# EAGLE design data_proV1.2 (EAGLE 7.6.0)
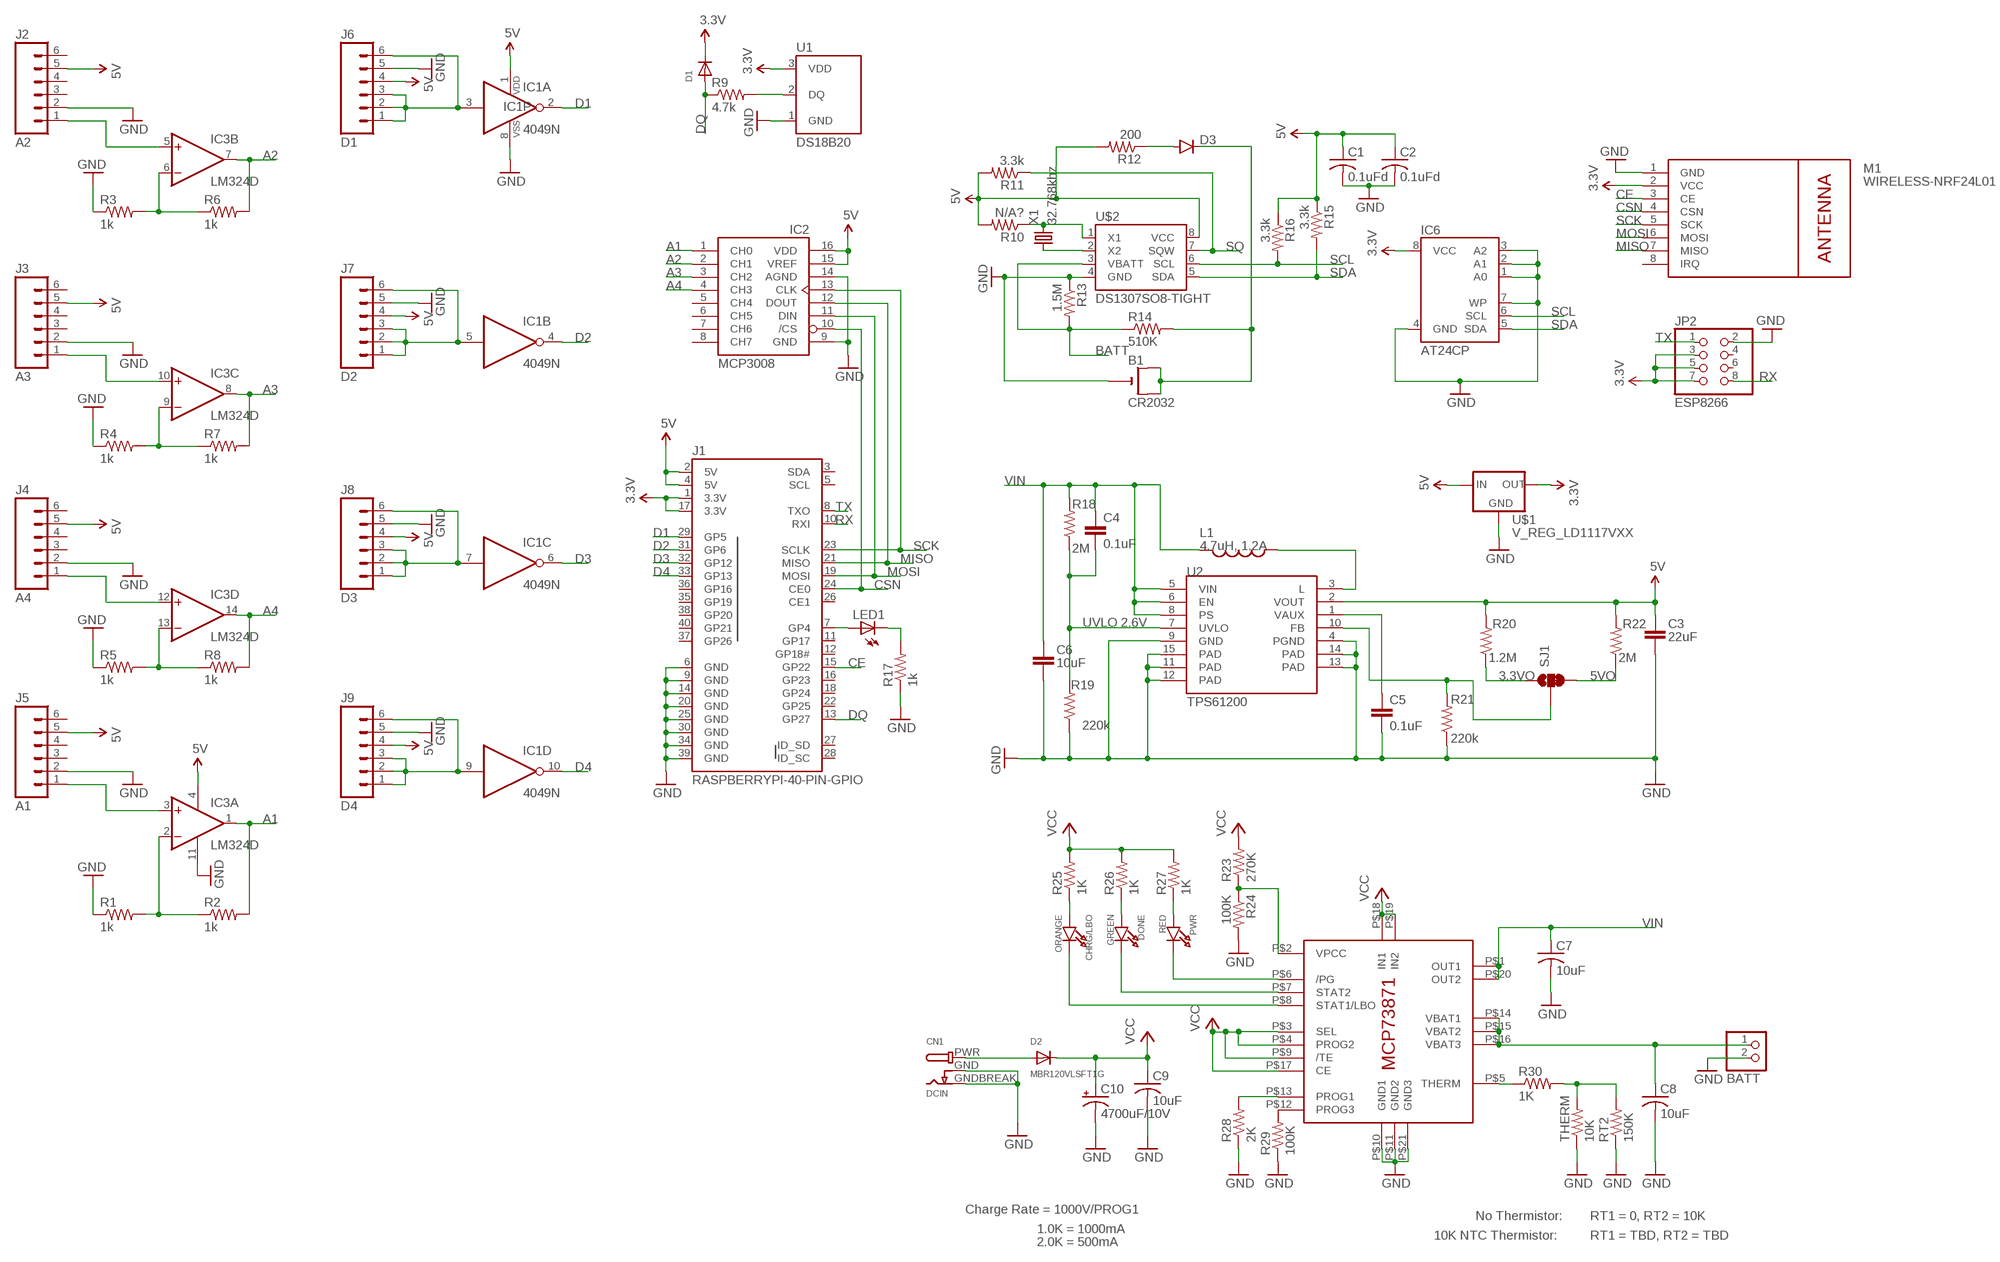
[diagram p0: schematic, sheet 1]

## Parts
B1  CR2032  CR2032SMT  [CR2032-SMD]
BATT  JST_2PIN-SMT-RA  [JST-PH-2-SMT-RA]
C1  0.1uFd  C-USC0805  [C0805]
C2  0.1uFd  C-USC0805  [C0805]
C3  22uF  CAP0805  [0805]
C4  0.1uF  CAP0603-CAP  [0603-CAP]
C5  0.1uF  CAP0603-CAP  [0603-CAP]
C6  10uF  CAP1206  [1206]
C7  10uF  C-USC0805K  [C0805K]
C8  10uF  C-USC0805K  [C0805K]
C9  10uF  C-USC0805K  [C0805K]
C10  4700uF/10V  CPOL-USE5-13  [E5-13]
CHRG/LBO  ORANGE  LED0805_NOOUTLINE  [CHIPLED_0805_NOOUTLINE]
CN1  DCIN  DCBARRELSMT  [DCJACK_2MM_SMT]
D1  DIODESOD-323F  [SOD-323F]
D2  MBR120VLSFT1G  DIODESOD-123  [SOD-123]
D3  DIODESMB  [SMB-DIODE]
DONE  GREEN  LED0805_NOOUTLINE  [CHIPLED_0805_NOOUTLINE]
IC1  4049N  [DIL16]
IC2  MCP3008  [DIL16]
IC3  LM324D  [SO14]
IC4  MCP73871  [QFN20_4MM]
IC6  AT24CP  [DIL08]
J1  RASPBERRYPI-40-PIN-GPIO  [2X20-SHROUDED]
J2  A2  M06VERNIER-ANALOG  [BTA]
J3  A3  M06VERNIER-ANALOG  [BTA]
J4  A4  M06VERNIER-ANALOG  [BTA]
J5  A1  M06VERNIER-ANALOG  [BTA]
J6  D1  M06VERNIER-DIGITAL  [BTD]
J7  D2  M06VERNIER-DIGITAL  [BTD]
J8  D3  M06VERNIER-DIGITAL  [BTD]
J9  D4  M06VERNIER-DIGITAL  [BTD]
JP2  ESP8266  PINHD-2X4  [2X04]
L1  4.7uH, 1.2A  INDUCTOR.  [CDRH2D09]
LED1  LEDCHIP-LED0805  [CHIP-LED0805]
M1  WIRELESS-NRF24L01  [WIRELESS-NRF24L01]
PWR  RED  LED0805_NOOUTLINE  [CHIPLED_0805_NOOUTLINE]
R1  1k  R-US_R0805  [R0805]
R2  1k  R-US_R0805  [R0805]
R3  1k  R-US_R0805  [R0805]
R4  1k  R-US_R0805  [R0805]
R5  1k  R-US_R0805  [R0805]
R6  1k  R-US_R0805  [R0805]
R7  1k  R-US_R0805  [R0805]
R8  1k  R-US_R0805  [R0805]
R9  4.7k  R-US_R0805  [R0805]
R10  N/A?  R-US_R0805  [R0805]
R11  3.3k  R-US_R0805  [R0805]
R12  200  R-US_R0805  [R0805]
R13  1.5M  R-US_R0805  [R0805]
R14  510K  R-US_R0805  [R0805]
R15  3.3k  R-US_R0805  [R0805]
R16  3.3k  R-US_R0805  [R0805]
R17  1k  R-US_R0805  [R0805]
R18  2M  RESISTOR0603-RES  [0603-RES]
R19  220k  RESISTOR0603-RES  [0603-RES]
R20  1.2M  RESISTOR0603-RES  [0603-RES]
R21  220k  RESISTOR0603-RES  [0603-RES]
R22  2M  RESISTOR0603-RES  [0603-RES]
R23  270K  R-US_R0805  [R0805]
R24  100K  R-US_R0805  [R0805]
R25  1K  R-US_R0805  [R0805]
R26  1K  R-US_R0805  [R0805]
R27  1K  R-US_R0805  [R0805]
R28  2K  R-US_FLIPFLOP  [0805-THM]
R29  100K  R-US_R0805  [R0805]
R30  1K  R-US_M0805  [M0805]
RT2  150K  R-US_M0805  [M0805]
SJ1  SOLDERJUMPER_2WAYPASTE2&3  [SJ_3_PASTE2&3]
THERM  10K  R-US_FLIPFLOP  [0805-THM]
U1  DS18B20  [TO-92-AMMO]
U2  TPS61200  [QFN-10_PAD]
U$1  V_REG_LD1117VXX  [78XXL]
U$2  DS1307SO8-TIGHT  [SO08-TIGHT]
X1  32.768khz  CRYSTALTC38H  [TC38H]

## Nets
3.3V: D1.C IC6.8(VCC) J1.1(3.3V) J1.17(3.3V) JP2.3 JP2.5 JP2.7 M1.2(VCC) U1.3(VDD) U$1.GND(OUT)
3.3VO: R20.1 SJ1.1
5V: C1.1 C2.1 C3.1 IC1.1(P:VDD) IC2.15(VREF) IC2.16(VDD) IC3.4(P:V+) J1.2(5V) J1.4(5V) J2.5 J3.5 J4.5 J5.5 J6.4 J7.4 J8.4 J9.4 R10.2 R11.2 R12.2 R15.1 R16.1 R20.2 R22.2 U2.2(VOUT) U$1.OUT(IN) U$2.8(VCC)
5VO: R22.1 SJ1.3
A1: IC2.1(CH0) IC3.1(A:OUT) R2.2
A2: IC2.2(CH1) IC3.7(B:OUT) R6.2
A3: IC2.3(CH2) IC3.8(C:OUT) R7.2
A4: IC2.4(CH3) IC3.14(D:OUT) R8.2
BATT: R13.2 R14.1 U$2.3(VBATT)
BATT1: BATT.1 C8.1 IC4.P$14(VBAT1) IC4.P$15(VBAT2) IC4.P$16(VBAT3)
CE: J1.15(GP22) M1.3(CE)
CSN: IC2.10(/CS) J1.24(CE0) M1.4(CSN)
D1: IC1.2(A:O) J1.29(GP5)
D2: IC1.4(B:O) J1.31(GP6)
D3: IC1.6(C:O) J1.32(GP12)
D4: IC1.10(D:O) J1.33(GP13)
DQ: D1.A J1.13(GP27) R9.1
FB: R21.2 SJ1.2 U2.10(FB)
GND: B1.- BATT.2 C1.2 C2.2 C3.2 C5.2 C6.2 C7.2 C8.2 C9.2 C10.- CN1.GND(GNDBREAK) CN1.GNDBREAK(GND) IC1.8(P:VSS) IC2.9(GND) IC2.14(AGND) IC3.11(P:V-) IC4.P$10(GND1) IC4.P$11(GND2) IC4.P$21(GND3) IC6.1(A0) IC6.2(A1) IC6.3(A2) IC6.4(GND) IC6.7(WP) J1.6(GND) J1.9(GND) J1.14(GND) J1.20(GND) J1.25(GND) J1.30(GND) J1.34(GND) J1.39(GND) J2.2 J3.2 J4.2 J5.2 J6.5 J7.5 J8.5 J9.5 JP2.2 M1.1(GND) R1.1 R3.1 R4.1 R5.1 R13.1 R17.1 R19.1 R21.1 R24.2 R28.1 R29.1 RT2.1 THERM.1 U1.1(GND) U2.4(PGND) U2.9(GND) U2.11(PAD) U2.12(PAD) U2.13(PAD) U2.14(PAD) U2.15(PAD) U$1.IN(GND) U$2.4(GND)
MISO: IC2.12(DOUT) J1.21(MISO) M1.7(MISO)
MOSI: IC2.11(DIN) J1.19(MOSI) M1.6(MOSI)
N$1: U$2.2(X2) X1.1
N$2: R10.1 U$2.1(X1) X1.2
N$3: B1.+$1(+) B1.+$2(+1) D3.C R14.2
N$4: J1.7(GP4) LED1.A
N$5: IC3.2(A:-IN) R1.2 R2.1
N$6: R9.2 U1.2(DQ)
N$7: IC3.13(D:-IN) R5.2 R8.1
N$8: IC3.6(B:-IN) R3.2 R6.1
N$9: L1.P$1 U2.3(L)
N$10: D3.A R12.1
N$11: IC1.3(A:I) J6.1 J6.2 J6.3 J6.6
N$12: IC1.5(B:I) J7.1 J7.2 J7.3 J7.6
N$13: C5.1 U2.1(VAUX)
N$14: IC1.7(C:I) J8.1 J8.2 J8.3 J8.6
N$15: IC1.9(D:I) J9.1 J9.2 J9.3 J9.6
N$16: IC3.9(C:-IN) R4.2 R7.1
N$17: LED1.C R17.2
N$18: IC4.P$2(VPCC) R23.1 R24.1
N$19: IC4.P$6(/PG) PWR.C
N$20: DONE.C IC4.P$7(STAT2)
N$21: CHRG/LBO.C IC4.P$8(STAT1/LBO)
N$22: CHRG/LBO.A R25.1
N$23: DONE.A R26.1
N$24: PWR.A R27.1
N$25: IC4.P$12(PROG3) R29.2
N$26: IC4.P$13(PROG1) R28.2
N$27: IC4.P$5(THERM) R30.1
N$28: R30.2 RT2.2 THERM.2
N$29: CN1.PWR D2.A
RX: J1.10(RXI) JP2.8
S1-5V1: IC3.5(B:+IN) J2.1
S1-5V2: IC3.10(C:+IN) J3.1
S1-5V3: IC3.3(A:+IN) J5.1
S1-5V4: IC3.12(D:+IN) J4.1
SCK: IC2.13(CLK) J1.23(SCLK) M1.5(SCK)
SCL: IC6.6(SCL) R16.2 U$2.6(SCL)
SDA: IC6.5(SDA) R15.2 U$2.5(SDA)
SQ: R11.1 U$2.7(SQW)
TX: J1.8(TXO) JP2.1
UVLO: C4.2 R18.1 R19.2 U2.7(UVLO)
VCC: C9.1 C10.+ D2.C IC4.P$3(SEL) IC4.P$4(PROG2) IC4.P$9(/TE) IC4.P$17(CE) IC4.P$18(IN1) IC4.P$19(IN2) R23.2 R25.2 R26.2 R27.2
VIN: C4.1 C6.1 C7.1 IC4.P$1(OUT1) IC4.P$20(OUT2) L1.P$2 R18.2 U2.5(VIN) U2.6(EN) U2.8(PS)
Unconnected: IC1.11(E:I) IC1.12(E:O) IC1.14(F:I) IC1.15(F:O) IC2.5(CH4) IC2.6(CH5) IC2.7(CH6) IC2.8(CH7) J1.3(SDA) J1.5(SCL) J1.11(GP17) J1.12(GP18#) J1.16(GP23) J1.18(GP24) J1.22(GP25) J1.26(CE1) J1.27(ID_SD) J1.28(ID_SC) J1.35(GP19) J1.36(GP16) J1.37(GP26) J1.38(GP20) J1.40(GP21) J2.3 J2.4 J2.6 J3.3 J3.4 J3.6 J4.3 J4.4 J4.6 J5.3 J5.4 J5.6 JP2.4 JP2.6 M1.8(IRQ)

## Notes on the sheet
- UVLO 2.6V
- Charge Rate = 1000V/PROG1
- No Thermistor: | RT1 = 0, RT2 = 10K
- 1.0K = 1000mA
- 10K NTC Thermistor: | RT1 = TBD, RT2 = TBD
- 2.0K = 500mA

## Library data of the parts
B1 = adafruit:CR2032
BATT = adafruit:JST_2PIN: JST 2-Pin Connectors of various flavors SMT-RA (S2B-PH-SM4) 4UConnector #17311 SMT (B2B-PH-SM4) THM-RA (S2B-PH) THM (B2B-PH)
C1 C2 = resistor:C-US: CAPACITOR, American symbol
C3 C6 = CH_passive:CAP: Capacitor Standard 0603 ceramic capacitor, and 0.1" leaded capacitor.
C4 C5 = SparkFun:CAP: Capacitor Standard 0603 ceramic capacitor, and 0.1" leaded capacitor.
C7-C9 = adafruit:C-US: CAPACITOR, American symbol
C10 = adafruit:CPOL-US: POLARIZED CAPACITOR, American symbol
CHRG/LBO DONE PWR = microbuilder:LED: LED
CN1 = microbuilder:DCBARREL: DC Barrel Jack DCJACK_1.3MM_PTH - Through Hole 1.3mm Jack (4UConnector: 05536) DCJACK_2MM_PTH - Through Hole 2.0/2.1 Jack (4UConnector: 05537) DCJACK_2MM_SMT - SMT 2.0/2.1mm Jack(4UConnector: 03267)
D1 = adafruit:DIODE: Diode
D2 = microbuilder:DIODE: Diode
D3 = SparkFun-DiscreteSemi:DIODE: Diode; PROD_ID: DIO-09646
IC1 = 40xx:4049: Hex inverting BUFFER
IC2 = adafruit:MCP3008
IC3 = linear:LM324: OP AMP
IC4 = adafruit:MCP73871
IC6 = atmel:AT24C*: 2-wire serial EEPROM; MPN: AT24C1024BW-SH-B; OC_FARNELL: 1362646; OC_NEWARK: 03P2044
J1 = SparkFun-Boards:RASPBERRYPI-40-PIN-GPIO: Second Generation Raspberry Pi GPIO Header 2x20 pin connector, as found on B, B+, A+ models.
J2-J9 = SparkFun-Connectors:M06: Header 6 Standard 6-pin 0.1" header. Use with straight break away headers (SKU : PRT-00116), right angle break away headers (PRT-00553), swiss pins (PRT-00743), machine pins (PRT-00117), and female headers (PRT-00115). Molex polarized connector foot print use with SKU : PRT-08094 with associated crimp pins and housings. NOTES ON THE VARIANTS LOCK and LOCK_LONGPADS... This footprint was designed to help hold the alignment of a through-hole component (i.e. 6-pin header) while soldering it into place. You may notice that each hole has been shifted either up or down by 0.005 of an inch from it's more standard position (which is a perfectly straight line). This slight alteration caused the pins (the squares in the middle) to touch the edges of the holes. Because they are alternating, it causes a "brace" to hold the component in place. 0.005 has proven to be the perfect amount of "off-center" position when using our standard breakaway headers. Although looks a little odd when you look at the bare footprint, once you have a header in there, the alteration is very hard to notice. Also,if you push a header all the way into place, it is covered up entirely on the bottom side. This idea of altering the position of holes to aid alignment will be further integrated into the Sparkfun Library for other footprints. It can help hold any component with 3 or more connection pins.
JP2 = adafruit:PINHD-2X4: PIN HEADER
L1 = SparkFun:INDUCTOR: Inductors Basic Inductor/Choke - 0603 and 1206. Footprints are not proven and vary greatly between part numbers.
LED1 = led:LED: LED
M1 = diy-modules:WIRELESS-NRF24L01: 2.4 GHz Wireless Module based on NRF24L01 chip More details available here: http://www.electrodragon.com/w/NRF24L01 Click here to find device on ebay.com <http://www.ebay.com/sch/nrf24l01+arduino>
R1-R9 = resistor:R-US_: RESISTOR, American symbol
R10-R17 R23-R30 RT2 THERM = adafruit:R-US_: RESISTOR, American symbol
R18-R22 = SparkFun:RESISTOR: Resistor Basic schematic elements and footprints for 0603, 1206, and PTH resistors.
SJ1 = SparkFun:SOLDERJUMPER_2WAY: Solder Jumper 2 way solder jumper
U1 = SparkFun-Sensors:DS18B20: Dallas/Maxim DS18B20 1-wire temperature sensor Datasheet: http://datasheets.maximintegrated.com/en/ds/DS18B20.pdf temp thermometer 1-wire one-wire one wire; STORE_ID: SEN-00245
U2 = SparkFun:TPS61200: DC to DC Booster
U$1 = SparkFun-PowerIC:V_REG_LD1117VXX: LD1117VXX voltage regulator. We carry the 3.3V version (COM-00526) in TO-220 package.
U$2 = SparkFun-FreqCtrl:DS1307: I2C real-time clock with battery backup.; PROD_ID: IC-08138
X1 = crystal:CRYSTAL: CRYSTAL; OC_FARNELL: unknown; OC_NEWARK: unknown

## Board
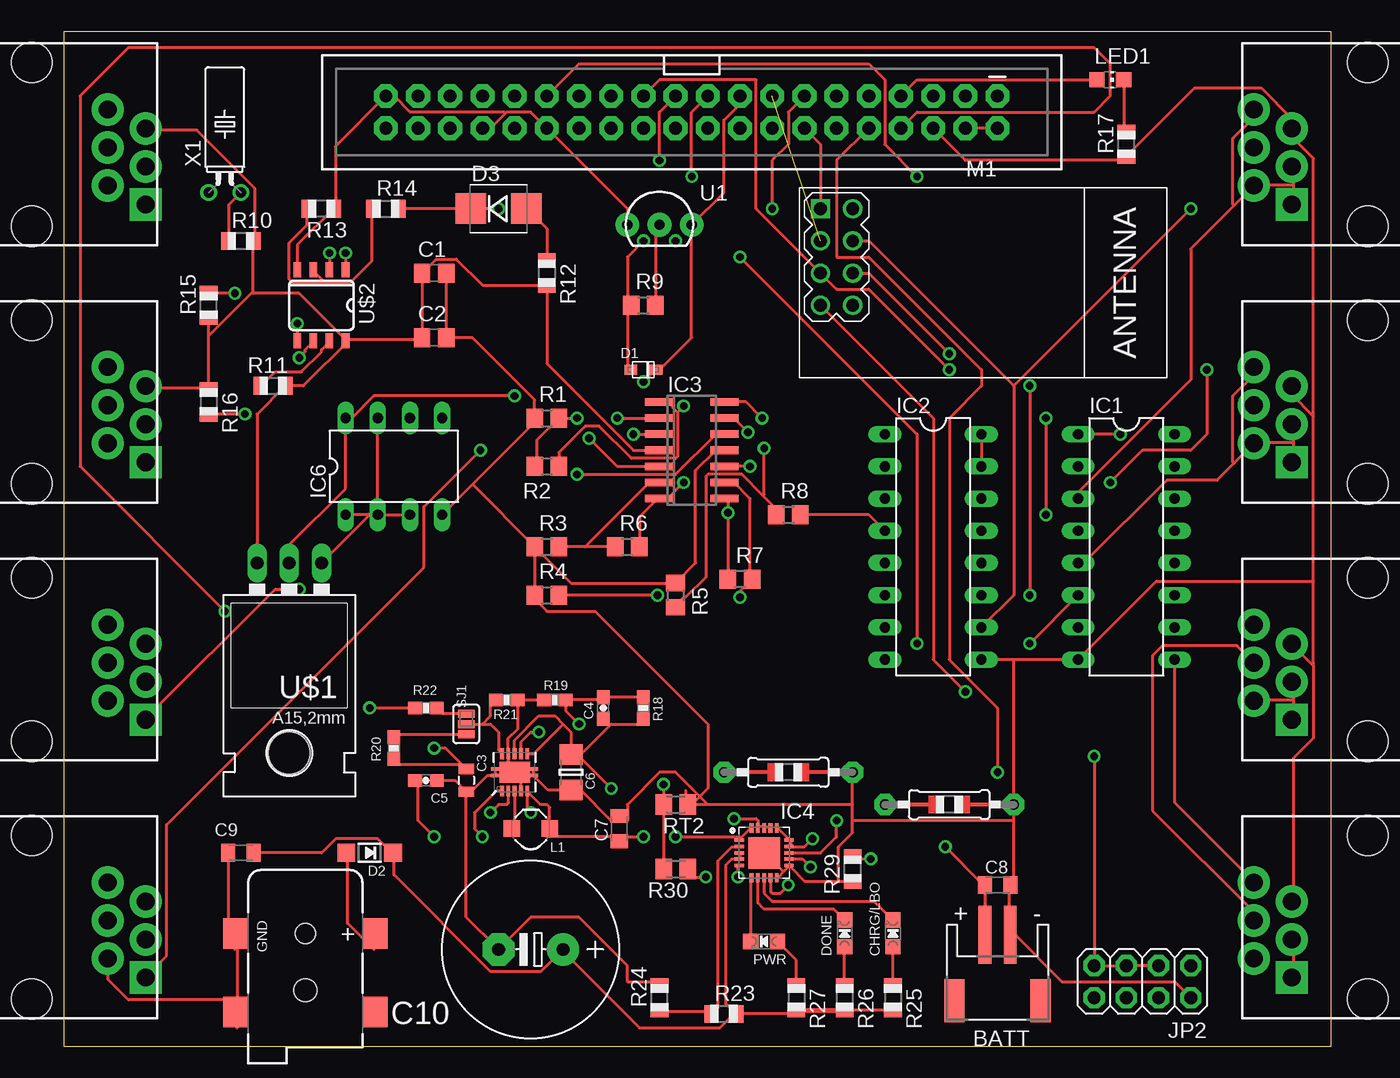
[diagram p1: board, top side]
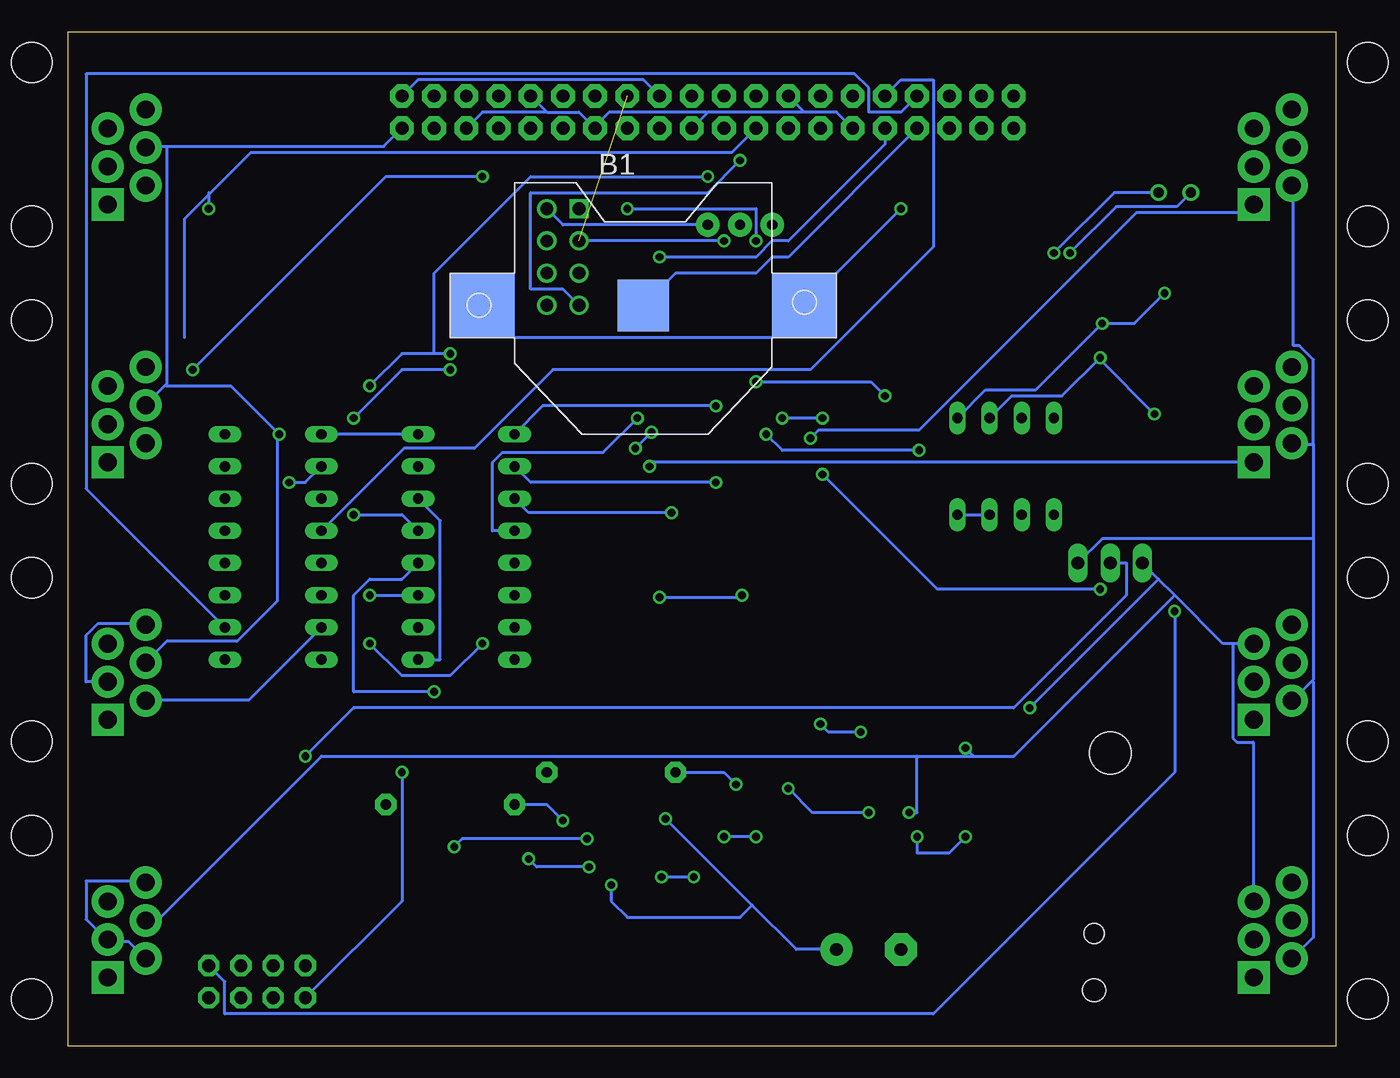
[diagram p2: board, bottom side, seen from below]

Size 100 x 80 mm. Coordinates in mm from the lower left corner, seen from the top.
Outline: 0,0 100,0 100,80 0,80 0,0
Copper layers (1*16): Top 0.035mm / dielectric 1.5mm / Bottom 0.035mm
Design rules "default": minimum track width 10mil, minimum drill 24mil, track to track 8mil, track to pad 8mil, pad to pad 8mil, via to via 8mil, smd to smd 8mil, copper to edge 40mil, drill to drill 8mil, minimum pad ring 10mil, minimum via ring 8mil, stop-mask expansion 4mil, vias tented up to drill 0mil, thermal gap 10mil

### Footprints (pad centres in the part's own frame; a part is rotated, then mirrored left to right if it is on the bottom)
CR2032-SMD = smd 5.08 x 5.08: +$1 -12.7,0; +$2 12.7,0 | smd 4.064 x 4.064: - 0,0
JST-PH-2-SMT-RA = smd 1 x 4.6: 1 1,-3.7; 2 -1,-3.7 | smd 1.6 x 3.4: NC1 -3.4,1.5; NC2 3.4,1.5
C0805 = smd 1.3 x 1.5: 1 -0.95,0; 2 0.95,0
0805 = smd 0.8 x 1.2: 1 -0.9,0; 2 0.9,0
0603-CAP = smd 1.1 x 1: 1 -0.85,0; 2 0.85,0
1206 = smd 1.6 x 1.8: 1 -1.4,0; 2 1.4,0
C0805K = smd 1.1 x 1.4: 1 -1,0; 2 1,0
E5-13 = drill 1.016 pad 2.54: + -2.54,0 | drill 1.016 pad 2.54 octagon: - 2.54,0
CHIPLED_0805_NOOUTLINE = smd 1.2 x 1.2: A 0,-1.05; C 0,1.05
DCJACK_2MM_SMT = smd 2.4 x 2: GND 0,-5.5; GNDBREAK 6.2,-5.5; PWR 0,5.5; PWR2 6.2,5.5 | hole 1.6: 0,0 | hole 1.8: 4.5,0
SOD-323F = smd 1 x 0.8: A -1,0; C 1,0
SOD-123 = smd 1.4 x 1.4: A 1.85,0; C -1.85,0
SMB-DIODE = smd 2.4 x 2.4: A 2.2,0; C -2.2,0
DIL16 = drill 0.813 long: 1 -8.89,-3.81; 2 -6.35,-3.81; 3 -3.81,-3.81; 4 -1.27,-3.81; 5 1.27,-3.81; 6 3.81,-3.81; 7 6.35,-3.81; 8 8.89,-3.81; 9 8.89,3.81; 10 6.35,3.81; 11 3.81,3.81; 12 1.27,3.81; 13 -1.27,3.81; 14 -3.81,3.81; 15 -6.35,3.81; 16 -8.89,3.81
SO14 = smd 0.6 x 2.2: 1 -3.81,-2.6; 2 -2.54,-2.6; 3 -1.27,-2.6; 4 0,-2.6; 5 1.27,-2.6; 6 2.54,-2.6; 7 3.81,-2.6; 8 3.81,2.6; 9 2.54,2.6; 10 1.27,2.6; 11 0,2.6; 12 -1.27,2.6; 13 -2.54,2.6; 14 -3.81,2.6
QFN20_4MM = smd 0.73 x 0.28: P$1 -1.965,1; P$2 -1.965,0.5; P$3 -1.965,0; P$4 -1.965,-0.5; P$5 -1.965,-1; P$11 1.965,-1; P$12 1.965,-0.5; P$13 1.965,0; P$14 1.965,0.5; P$15 1.965,1 | smd 0.28 x 0.73: P$6 -1,-1.965; P$7 -0.5,-1.965; P$8 0,-1.965; P$9 0.5,-1.965; P$10 1,-1.965; P$16 1,1.965; P$17 0.5,1.965; P$18 0,1.965; P$19 -0.5,1.965; P$20 -1,1.965 | smd 2.5 x 2.5: P$21 0,0
DIL08 = drill 0.813 long: 1 -3.81,-3.81; 2 -1.27,-3.81; 3 1.27,-3.81; 4 3.81,-3.81; 5 3.81,3.81; 6 1.27,3.81; 7 -1.27,3.81; 8 -3.81,3.81
2X20-SHROUDED = drill 1.016 pad 1.88 octagon: 1 -1.27,24.13; 2 1.27,24.13; 3 -1.27,21.59; 4 1.27,21.59; 5 -1.27,19.05; 6 1.27,19.05; 7 -1.27,16.51; 8 1.27,16.51; 9 -1.27,13.97; 10 1.27,13.97; 11 -1.27,11.43; 12 1.27,11.43; 13 -1.27,8.89; 14 1.27,8.89; 15 -1.27,6.35; 16 1.27,6.35; 17 -1.27,3.81; 18 1.27,3.81; 19 -1.27,1.27; 20 1.27,1.27; 21 -1.27,-1.27; 22 1.27,-1.27; 23 -1.27,-3.81; 24 1.27,-3.81; 25 -1.27,-6.35; 26 1.27,-6.35; 27 -1.27,-8.89; 28 1.27,-8.89; 29 -1.27,-11.43; 30 1.27,-11.43; 31 -1.27,-13.97; 32 1.27,-13.97; 33 -1.27,-16.51; 34 1.27,-16.51; 35 -1.27,-19.05; 36 1.27,-19.05; 37 -1.27,-21.59; 38 1.27,-21.59; 39 -1.27,-24.13; 40 1.27,-24.13
BTA = drill 1.4 pad 2.54 square: 1 4.75,9 | drill 1.4 pad 2.54: 2 3.25,6; 3 1.75,9; 4 0.25,6; 5 -1.25,9; 6 -2.75,6 | hole 3.2: 6.45,0; -6.45,0
BTD = drill 1.4 pad 2.54 square: 1 -4.75,6 | drill 1.4 pad 2.54: 2 -3.25,9; 3 -1.75,6; 4 -0.25,9; 5 1.25,6; 6 2.75,9 | hole 3.2: 6.45,0; -6.45,0
2X04 = drill 1.016 pad 1.676 octagon: 1 -3.81,-1.27; 2 -3.81,1.27; 3 -1.27,-1.27; 4 -1.27,1.27; 5 1.27,-1.27; 6 1.27,1.27; 7 3.81,-1.27; 8 3.81,1.27
CDRH2D09 = smd 1.3 x 1.3: P$1 -1.5,0; P$2 1.5,0
CHIP-LED0805 = smd 1.2 x 1.2: A 0,-1.05; C 0,1.05
WIRELESS-NRF24L01 = drill 1 square: 1 -12.7,6.35 | drill 1: 2 -10.16,6.35; 3 -12.7,3.81; 4 -10.16,3.81; 5 -12.7,1.27; 6 -10.16,1.27; 7 -12.7,-1.27; 8 -10.16,-1.27
R0805 = smd 1.3 x 1.5: 1 -0.95,0; 2 0.95,0
R0805' = smd 1.1 x 1.4: 1 -1,0; 2 1,0
0603-RES = smd 1.1 x 1: 1 -0.85,0; 2 0.85,0
0805-THM = drill 0.813 pad 1.676 octagon: 1 -5.08,0; 2 5.08,0
M0805 = smd 1.3 x 1.6: 1 -0.95,0; 2 0.95,0
SJ_3_PASTE2&3 = smd 0.635 x 1.27: 1 -0.813,0; 2 0,0; 3 0.813,0
TO-92-AMMO = drill 0.813 pad 1.88: 1 -2.54,0; 2 0,0; 3 2.54,0
QFN-10_PAD = smd 0.297 x 0.85: 1 -1,-1.475; 2 -0.5,-1.475; 3 0,-1.475; 4 0.5,-1.475; 5 1,-1.475; 6 1,1.475; 7 0.5,1.475; 8 0,1.475; 9 -0.5,1.475; 10 -1,1.475 | smd 0.7 x 0.28: 11 -1.5,0.25; 12 -1.5,-0.25; 13 1.5,0.25; 14 1.5,-0.25 | smd 2.4 x 1.65: 15 0,0
78XXL = drill 1.016 long: GND 0,-3.81; IN -2.54,-3.81; OUT 2.54,-3.81 | hole 3.302: 0,11.176
SO08-TIGHT = smd 0.6 x 1.2: 1 -1.905,-2.8; 2 -0.635,-2.8; 3 0.635,-2.8; 4 1.905,-2.8; 5 1.905,2.8; 6 0.635,2.8; 7 -0.635,2.8; 8 -1.905,2.8
TC38H = drill 0.813: 1 -1.27,0; 2 1.27,0

### Placement (x,y rotation side)
B1  54.61,58.42 0 bottom
BATT  73.66,5.08 180 top
C1  29.21,60.96 0 top
C2  29.21,55.88 0 top
C3  31.75,20.95 270 top
C4  42.55,26.67 90 top
C5  28.57,20.95 0 top
C6  40.01,21.59 270 top
C7  43.81,17.14 90 top
C8  73.66,12.7 0 top
C9  13.97,15.24 180 top
C10  36.83,7.62 180 top
CHRG/LBO  65.41,8.89 0 top
CN1  19.05,8.89 270 top
D1  45.72,53.34 0 top
D2  24.13,15.24 180 top
D3  34.29,66.04 0 top
DONE  61.59,8.89 0 top
IC1  83.82,39.37 270 top
IC2  68.58,39.37 270 top
IC3  49.53,46.99 270 top
IC4  55.24,15.24 0 top
IC6  26.04,45.72 0 top
J1  49.53,73.66 270 top
J2  -2.54,71.12 270 top
J3  -2.54,50.8 270 top
J4  -2.54,30.48 270 top
J5  -2.54,10.16 270 top
J6  102.87,71.12 90 top
J7  102.87,50.8 90 top
J8  102.87,30.48 90 top
J9  102.87,10.16 90 top
JP2  85.09,5.08 180 top
L1  36.83,17.14 0 top
LED1  82.55,76.2 270 top
M1  72.39,59.69 0 top
PWR  55.24,8.26 90 top
R1  38.1,49.53 0 top
R2  38.1,45.72 0 top
R3  38.1,39.37 0 top
R4  38.1,35.56 0 top
R5  48.26,35.56 270 top
R6  44.45,39.37 0 top
R7  53.34,36.83 180 top
R8  57.15,41.91 0 top
R9  45.72,58.42 0 top
R10  N/A?  [R0805']  13.97,63.5 0 top
R11  3.3k  [R0805']  16.51,52.07 0 top
R12  200  [R0805']  38.1,60.96 270 top
R13  1.5M  [R0805']  20.32,66.04 180 top
R14  510K  [R0805']  25.4,66.04 0 top
R15  3.3k  [R0805']  11.43,58.42 90 top
R16  3.3k  [R0805']  11.43,50.8 270 top
R17  1k  [R0805']  83.82,71.12 90 top
R18  45.72,26.67 270 top
R19  38.73,27.3 0 top
R20  26.04,23.5 270 top
R21  34.92,27.3 180 top
R22  28.57,26.67 180 top
R23  270K  [R0805']  52.07,2.54 0 top
R24  100K  [R0805']  46.99,3.81 90 top
R25  1K  [R0805']  65.41,3.81 270 top
R26  1K  [R0805']  61.59,3.81 270 top
R27  1K  [R0805']  57.78,3.81 270 top
R28  69.85,19.05 180 top
R29  100K  [R0805']  62.23,13.97 90 top
R30  48.26,13.97 180 top
RT2  48.26,19.05 180 top
SJ1  31.75,25.4 90 top
THERM  57.15,21.59 180 top
U1  46.99,64.77 0 top
U2  35.56,21.59 0 top
U$1  17.78,34.29 180 top
U$2  20.32,58.42 180 top
X1  12.7,67.31 0 top

### Tracks (layer width: path | path; a pad name or v marks a point on that pad's centre or on a via)
3.3V  (via drill 0.61)
  Top 0.254: JP2.3 JP2.5 JP2.7 v81.28,22.86 | U$1.GND 17.78,39.53 22.23,43.97 IC6.8 22.7,49.53 24.45,51.28 v35.56,51.28 | J1.17 53.34,74.3 52.07,73.03 52.07,67.31 U1.3 49.53,55.88 46.99,53.34 D1.C 46.67,53.34 v45.72,52.39
  Bottom 0.254: J1.1 72.39,76.2 54.61,76.2 J1.17 | v35.56,51.28 36.67,52.39 v45.72,52.39 | M1.2 60.96,64.77 U1.3 | v81.28,22.86 77.47,26.67 25.4,26.67 16.51,35.56 16.51,38.1 U$1.GND
3.3VO
  Top 0.254: R20.1 26.28,24.59 SJ1.1
5V  (via drill 0.6, 0.61)
  Top 0.254: 11.43,51.91 6.51,51.91 J3.5 | 11.43,51.91 11.43,56.04 | 11.43,56.04 R15.1 | 11.43,51.91 R16.1 | 11.43,56.04 14.84,59.45 | 14.84,59.45 14.92,59.53 14.92,63.5 R10.2 15.08,63.5 15.08,67.63 10.48,72.23 6.51,72.23 J2.5 | 22.54,55.72 28.1,55.72 C2.1 | 22.54,55.72 22.23,55.72 | 22.54,55.72 18.89,52.07 R11.2 17.46,52.07 15.24,49.85 U$1.OUT | C1.1 29.37,62.07 30.96,62.07 33.02,60.01 38.1,60.01 R12.2 38.1,53.82 44.93,46.99 IC3.4 | C1.1 C2.1 | C2.1 | C1.1 | 22.23,55.72 18.57,59.37 14.92,59.37 14.84,59.45 | 22.23,55.72 U$2.8 | J9.4 93.82,10 93.82,10.64 85.88,18.57 85.88,30.8 86.68,31.59 92.55,31.59 93.82,30.32 J8.4 | IC2.16 IC2.15 | J1.2 J1.4 | v83.34,48.26 IC1.1 | v24.13,26.67 R22.2 | R20.2 26.45,22.23 31.11,22.23 31.48,21.86 C3.1 30.11,23.5 v29.21,23.5 | U2.2 35.06,19.18 34.92,19.05 34.29,19.05 v33.66,18.41
  Bottom 0.254: 12.7,35.56 8.89,31.75 8.1,31.75 | 12.7,35.56 13.97,36.83 | 13.97,36.83 U$1.OUT 15.24,37.94 | 8.1,31.75 6.51,31.75 J4.5 | 8.1,31.75 8.1,24.29 7.78,23.97 6.51,23.97 6.51,11.43 J5.5 | IC2.16 IC1.1 | J1.2 75.09,70.96 92.23,70.96 | 92.23,70.96 93.82,70.96 J6.4 | 92.31,52.15 92.23,52.23 92.23,70.96 | 92.31,52.15 93.82,50.64 J7.4 | 92.31,52.15 92.23,52.07 87.15,52.07 v83.34,48.26 83.5,48.26 83.5,35.08 86.68,31.91 92.23,31.91 93.82,30.32 J8.4 | 13.97,36.83 v24.13,26.67 | 12.7,35.56 25.4,22.86 28.57,22.86 | 33.02,22.86 80.01,22.86 92.71,10.16 J9.4 | 33.02,22.86 28.57,22.86 | v29.21,23.5 28.57,22.86 | v33.66,18.41 33.02,18.41 33.02,22.86
5VO
  Top 0.254: SJ1.3 29.88,26.21 R22.1
A1  (via drill 0.61)
  Top 0.254: 48.42,50.01 48.42,46.51 48.26,46.35 44.77,46.35 42.23,48.9 41.12,48.9 39.05,46.83 R2.2 | 48.42,50.01 47.62,50.8 IC3.1 | 48.42,50.01 v48.9,50.48
  Bottom 0.254: IC2.1 62.55,50.48 v48.9,50.48
A2  (via drill 0.61)
  Top 0.254: R6.2 45.4,41.75 46.83,43.18 IC3.7 47.62,43.18 v48.9,44.45
  Bottom 0.254: IC2.2 63.5,44.45 v48.9,44.45
A3  (via drill 0.61)
  Top 0.254: R7.2 v52.39,42.07 52.39,43.02 52.23,43.18 IC3.8
  Bottom 0.254: IC2.3 63.66,42.07 v52.39,42.07
A4  (via drill 0.61)
  Top 0.254: R8.2 63.5,41.91 IC2.4 | IC3.14 53.82,50.8 v55.09,49.53
  Bottom 0.254: v55.09,49.53 57.78,46.83 65.72,46.83 66.52,46.04 66.52,40.64 IC2.4
BATT
  Top 0.254: 20.56,60.25 20.64,60.17 22.54,60.17 24.29,61.91 24.29,66.04 R14.1 | 20.56,60.25 19.68,61.12 U$2.3 | R13.2 19.21,66.04 19.21,64.77 17.78,63.34 17.78,60.48 18.1,60.17 20.48,60.17 20.56,60.25
BATT1  (via drill 0.61)
  Top 0.254: IC4.P$16 56.36,17.14 57.15,16.35 IC4.P$15 57.31,16.19 57.31,15.88 IC4.P$14 57.31,15.72 58.42,15.72 v59.05,16.35 | BATT.1 72.71,7.62 72.71,12.7 C8.1 72.55,12.7 v69.53,15.72
  Bottom 0.254: v59.05,16.35 68.9,16.35 v69.53,15.72
CE  (via drill 0.61)  (1 unrouted)
  Bottom 0.254: v48.26,63.5 M1.3
CSN  (via drill 0.61)
  Top 0.254: IC2.10 74.93,35.56 74.93,52.07 | 74.93,52.07 63.5,63.5 M1.4 | v88.9,66.04 74.93,52.07
  Bottom 0.254: J1.24 47.62,70.48 85.57,70.48 88.82,67.23 | 88.82,67.23 90.81,65.25 90.81,55.88 | v88.9,66.04 88.9,67.31 88.82,67.23
D1  (via drill 0.61)
  Top 0.254: v82.55,44.45 85.09,46.99 88.9,46.99 90.17,48.26 v90.17,53.34 | v67.31,68.58 64.77,71.12 64.77,76.2 63.5,77.47 40.64,77.47 J1.29
  Bottom 0.254: IC1.2 81.28,44.45 v82.55,44.45 | v90.17,53.34 74.93,68.58 v67.31,68.58
D2
  Bottom 0.254: IC1.4 73.5,47.15 67.94,47.15 61.75,53.34 41.43,53.34 31.75,63.02 31.75,76.2 34.29,76.2 J1.31
D3  (via drill 0.61)
  Top 0.254: v76.2,31.75 IC1.6 | v67.31,31.75 67.31,48.26 v53.34,62.23
  Bottom 0.254: v76.2,31.75 73.66,29.21 69.85,29.21 v67.31,31.75 | v53.34,62.23 45.72,62.23 44.45,63.5 43.18,63.5 35.56,71.12 J1.32
D4
  Bottom 0.254: IC1.10 98.58,43.97 98.58,76.68 37.94,76.68 36.83,75.56 36.83,73.66 34.29,73.66 J1.33
DQ  (via drill 0.61)
  Top 0.254: 44.45,58.42 44.45,53.34 D1.A | 44.45,58.42 44.45,62.23 v45.72,63.5 | v55.88,66.04 55.88,69.85 57.15,71.12 57.15,73.66 J1.13 | 44.45,58.42 R9.1
  Bottom 0.254: v45.72,63.5 45.72,66.04 v55.88,66.04
FB
  Top 0.254: SJ1.2 33.02,25.4 | 33.02,25.4 33.66,26.04 33.66,26.89 R21.2 | 33.02,25.4 33.66,25.4 34.29,24.77 34.29,23.34 U2.10
GND
  Top 0.254: 98.5,30.08 97,31.59 J8.5 | 98.5,30.08 98.58,30 98.58,24.29 97,22.7 97,11.43 J9.5 | 98.5,49.77 98.58,49.69 98.58,36.67 | 98.5,49.77 97,51.28 97,51.91 J7.5 | 98.58,36.67 98.58,30.16 98.5,30.08 | 98.5,49.77 98.58,49.85 98.58,70.01 97,71.6 97,72.23 J6.5 96.84,72.39 96.84,73.18 94.46,75.56 89.22,75.56 83.82,70.17 R17.1 83.82,69.85 71.12,69.85 J1.6 | 49.05,20.16 49.05,19.05 RT2.1 49.53,19.05 | 74.93,30.48 IC1.8 86.2,36.67 98.58,36.67 | 74.93,30.48 IC2.9 | 56.75,13.73 57.15,14.13 IC4.P$11 57.31,14.13 58.42,13.02 61.12,13.02 | 56.75,13.73 56.36,13.34 IC4.P$10 | IC4.P$21 56.75,13.73 | 61.12,13.02 62.23,13.02 R29.1 | 62.23,17.78 62.23,16.83 61.12,15.72 61.12,13.02 | 62.23,17.78 62.23,19.05 | 62.23,19.05 THERM.1 | 74.93,17.78 74.93,12.86 74.77,12.7 C8.2 74.61,12.7 74.61,7.62 BATT.2 74.93,8.89 78.74,5.08 87.63,5.08 JP2.2 | 74.93,17.78 R28.1 74.93,30.48 | 74.93,17.78 62.23,17.78 | 62.23,19.05 50.8,19.05 | 50.8,19.05 49.53,19.05 | U$2.4 18.41,63.18 21.27,66.04 R13.1 21.43,66.04 21.43,70.96 J1.39 26.04,74.93 27.3,73.66 34.77,73.66 34.85,73.58 | J1.34 33.66,72.39 34.85,73.58 | 34.85,73.58 34.92,73.66 36.83,73.66 J1.30 44.45,66.04 U1.1 | 24.13,41.91 IC6.1 | IC6.2 IC6.3 | IC6.2 IC6.7 | 24.13,41.91 U$1.IN | 24.13,41.91 IC6.2 | R3.1 37.15,35.72 | 37.15,35.72 R4.1 | R5.1 40.01,36.51 R3.1 | C2.2 C1.2 | R1.1 37.15,49.21 32.23,44.29 | IC6.4 32.23,44.29 | C2.2 32.23,55.88 37.15,50.96 R1.1 | C2.2 | R1.1 | 32.23,44.29 R3.1 | R3.1 | C9.2 13.02,15.24 13.02,8.1 13.49,7.62 CN1.GND 13.65,7.62 13.65,3.65 | 13.65,3.65 13.65,1.43 CN1.GNDBREAK | 13.65,3.65 5.08,3.65 3.49,5.24 3.49,6.83 J5.2 | IC3.11 51.44,46.99 49.85,45.4 49.85,38.1 R5.1 | R5.1
  Top 0.254: 37.15,35.72 R4.1 | C3.2 31.75,10.16 C10.- 36.83,10.16 40.64,10.16 44.45,6.35 44.45,5.08 46.99,5.08 R24.2 | 50.8,19.05 48.26,21.59 46.99,21.59 44.45,19.05 44.45,17.78 C7.2 43.18,17.78 40.64,20.32 C6.2 38.21,20.19 U2.14 U2.13 35.81,21.84 U2.15 | R19.1 R21.1 35.77,24.98 35.06,24.27 U2.9 35.06,22.09 U2.15 | C3.2 32.12,20.05 33.41,21.34 U2.12 U2.11 35.31,21.84 U2.15 | U2.4 36.06,21.09 U2.15 | C5.2 30.85,20.95 C3.2 | M1.1 59.69,71.12 J1.14 | 49.53,19.05 50.8,20.32 50.8,25.4 41.91,34.29 38.1,34.29 36.83,35.56 R4.1
  Bottom 0.254: IC2.14 70.64,41.43 70.64,30.48 IC2.9 | J1.9 62.31,73.74 | 62.31,73.74 62.23,73.66 59.69,73.66 J1.14 58.42,72.55 57.31,73.66 49.69,73.66 49.61,73.58 | J1.6 67.31,73.66 62.39,73.66 62.31,73.74 | 41.99,73.74 41.91,73.66 39.37,73.66 J1.30 | 41.99,73.74 J1.25 | 49.61,73.58 49.53,73.66 42.07,73.66 41.99,73.74 | 49.61,73.58 J1.20 | IC6.4 IC6.3 | 1.83,28.81 1.75,28.89 1.75,40.01 | 1.83,28.81 3.33,27.3 J4.2 | 1.75,47.47 1.75,40.01 | 1.75,47.47 3.33,47.47 J3.2 | 1.75,47.47 1.75,54.13 2.86,55.24 3.33,55.24 3.33,67.79 J2.2 | J5.2 3.33,6.99 1.75,8.57 1.75,28.73 1.83,28.81 | U$1.IN 18.41,40.01 1.75,40.01 | B1.- 52.07,60.96 45.72,60.96 44.45,62.23 43.18,62.23 J1.34
MISO  (via drill 0.61)
  Top 0.254: v71.12,27.94 68.58,30.48 68.58,49.53 M1.7 | J1.21 46.99,73.66 v46.99,69.85
  Bottom 0.254: IC2.12 73.66,36.83 76.2,36.83 77.47,35.56 77.47,27.94 v71.12,27.94 | v46.99,69.85 49.53,67.31 63.5,67.31 63.5,59.69 60.96,59.69 M1.7
MOSI  (via drill 0.61)
  Top 0.254: v76.2,52.07 v76.2,35.56 | v69.85,54.61 63.5,60.96 M1.6 | J1.19 49.53,73.66 v49.53,68.58
  Bottom 0.254: v76.2,35.56 IC2.11 | v76.2,52.07 73.66,54.61 71.12,54.61 | v69.85,54.61 71.12,54.61 | v49.53,68.58 63.5,68.58 71.12,60.96 71.12,54.61
N$1  (via drill 0.61)
  Top 0.254: v20.95,62.55 U$2.2
  Bottom 0.254: v20.95,62.55 17.3,66.2 12.54,66.2 X1.1
N$2  (via drill 0.61)
  Top 0.254: v22.23,62.55 U$2.1 | X1.2 13.02,66.36 13.02,63.5 R10.1
  Bottom 0.254: v22.23,62.55 17.46,67.31 X1.2
N$3  (via drill 0.61)
  Top 0.254: R14.2 D3.C v34.29,66.04
  Bottom 0.254: v34.29,66.04 B1.+$2 44.45,55.88 64.77,55.88 B1.+$1
N$4
  Top 0.254: LED1.A 67.31,76.2 J1.7
N$5  (via drill 0.61)
  Top 0.254: R1.2 37.31,47.78 37.31,45.72 R2.1 | v43.66,49.53 IC3.2 | R1.2 v40.48,49.53 | R1.2
  Bottom 0.254: v40.48,49.53 v43.66,49.53
N$6
  Top 0.254: U1.2 46.67,64.45 R9.2
N$7  (via drill 0.61)
  Top 0.254: 55.17,43.42 56.2,42.39 R8.1 | 55.17,43.42 53.5,45.09 50.8,45.09 50.64,44.93 50.64,36.99 49.05,35.4 48.9,35.4 48.26,34.77 R5.2 | IC3.13 52.86,49.53 v53.98,48.42 | v55.24,47.15 55.24,43.5 55.17,43.42
  Bottom 0.254: v55.24,47.15 v53.98,48.42
N$8
  Top 0.254: R6.1 41.12,39.37 | 41.12,39.37 R3.2 | IC3.6 46.2,44.45 41.12,39.37
N$9
  Top 0.254: U2.3 35.56,17.38 L1.P$1
N$10
  Top 0.254: R12.1 38.1,64.45 36.51,66.04 D3.A
N$11
  Top 0.254: 97,67.94 97,69.22 J6.3 | 97,67.94 97,66.52 J6.1 | IC1.3 80.01,43.66 88.9,52.55 88.9,62.87 92.31,66.28 | 92.31,66.28 93.82,67.79 J6.2 93.98,67.94 97,67.94 | J6.6 93.82,73.82 93.82,73.18 92.23,71.6 92.23,66.36 92.31,66.28
N$12
  Top 0.254: 97,47.62 97,48.9 J7.3 | 97,47.62 97,46.2 J7.1 | IC1.5 80.49,38.1 87,44.61 90.96,44.61 92.31,45.96 | 92.31,45.96 93.82,47.47 J7.2 93.98,47.62 97,47.62 | J7.6 93.82,53.5 93.82,52.86 92.23,51.28 92.23,46.04 92.31,45.96
N$13  (via drill 0.6)
  Top 0.254: U2.1 34.09,20.11 32.38,18.41 32.38,17.14 v33.02,16.51 | v29.21,16.51 27.94,17.78 27.94,20.74 C5.1
  Bottom 0.254: v33.02,16.51 33.02,15.24 30.48,15.24 v29.21,16.51
N$14
  Top 0.254: 97,27.3 97,28.57 J8.3 | 97,27.3 97,25.88 J8.1 | 97,27.3 93.98,27.3 J8.2
  Bottom 0.254: J8.6 93.98,33.34 97.63,33.34 98.58,32.38 98.58,28.73 97,28.73 J8.3 | IC1.7 85.72,27.3 93.82,27.3 J8.2
N$15
  Top 0.254: J9.1 97,5.56 97,8.26 J9.3 | IC1.9 87.63,19.21 93.82,13.02 J9.6
  Bottom 0.254: J9.2 93.98,6.99 95.25,8.26 96.84,8.26 J9.3 97,8.41 98.58,10 98.58,13.02 93.98,13.02 J9.6
N$16  (via drill 0.61)
  Top 0.254: v46.83,35.56 R4.2 | v53.34,35.4 53.34,35.88 R7.1 54.13,36.83 54.13,43.18 52.86,44.45 IC3.9
  Bottom 0.254: v46.83,35.56 46.99,35.4 v53.34,35.4
N$17
  Top 0.254: LED1.C 83.66,76.2 83.66,72.39 83.82,72.23 R17.2
N$18
  Top 0.254: IC4.P$2 53.18,15.72 52.7,15.72 51.59,14.61 51.59,3.02 51.12,2.54 R23.1 51.12,2.7 46.99,2.7 R24.1
N$19
  Top 0.254: PWR.C 54.2,13.22 IC4.P$6
N$20
  Top 0.254: DONE.C 60.74,10.79 55.24,10.79 54.74,11.29 IC4.P$7
N$21
  Top 0.254: CHRG/LBO.C 63.91,11.43 55.88,11.43 55.24,12.06 IC4.P$8
N$22
  Top 0.254: R25.1 CHRG/LBO.A
N$23
  Top 0.254: R26.1 DONE.A
N$24
  Top 0.254: R27.1 57.78,6.76 PWR.A
N$25  (via drill 0.61)
  Top 0.254: v63.66,14.76 62.39,14.76 62.23,14.92 R29.2 | IC4.P$12 57.31,14.76 58.26,14.76 v58.9,14.13
  Bottom 0.254: v58.9,14.13 63.02,14.13 v63.66,14.76
N$26  (via drill 0.6)
  Top 0.254: IC4.P$13 59.69,15.24 60.96,16.51 v60.96,17.78
  Bottom 0.254: v60.96,17.78 62.23,19.05 R28.2
N$27  (via drill 0.61)
  Top 0.254: v53.18,13.34 53.18,14.13 IC4.P$5 | v50.64,13.34 49.85,13.34 R30.1
  Bottom 0.254: v50.64,13.34 v53.18,13.34
N$28  (via drill 0.61)
  Top 0.254: RT2.2 R30.2 | v47.31,20.64 RT2.2 | RT2.2
  Bottom 0.254: v47.31,20.64 48.26,21.59 THERM.2
N$29
  Top 0.254: D2.A 22.38,15.24 22.38,9.68 24.45,7.62 CN1.PWR
RX  (via drill 0.61)
  Top 0.254: v73.66,21.59 73.66,26.67 69.85,30.48 69.85,49.53 72.39,52.07 72.39,53.34 63.5,62.23 60.96,62.23 60.96,69.85 J1.10
  Bottom 0.254: JP2.8 73.66,11.43 v73.66,21.59
S1-5V1  (via drill 0.61)
  Top 0.254: IC3.5 43.66,45.72 v41.43,47.94
  Bottom 0.254: v41.43,47.94 40.8,48.58 32.86,48.58 15.72,65.72 7.14,65.72 6.51,66.36 J2.1
S1-5V2  (via drill 0.61)
  Top 0.254: v54.13,45.72 IC3.10
  Bottom 0.254: v54.13,45.72 53.82,46.04 6.51,46.04 J3.1
S1-5V3  (via drill 0.61)
  Top 0.254: v44.93,48.26 IC3.3 | v32.86,46.99 28.42,42.55 28.42,37.78 8.1,17.46 8.1,7.14 6.51,5.56 J5.1
  Bottom 0.254: v44.93,48.26 43.66,46.99 v32.86,46.99
S1-5V4  (via drill 0.61)
  Top 0.254: IC3.12 51.44,48.26 48.26,45.09 v40.48,45.09 | v18.57,36.04 16.67,36.04 6.51,25.88 J4.1
  Bottom 0.254: v40.48,45.09 31.43,36.04 v18.57,36.04
SCK  (via drill 0.61)
  Top 0.254: v77.47,49.53 v77.47,41.91 | v69.85,53.34 63.5,59.69 60.96,59.69 M1.5 54.61,66.04 54.61,76.2 46.99,76.2 J1.23
  Bottom 0.254: IC2.13 73.66,41.91 v77.47,41.91 | v77.47,49.53 73.66,53.34 v69.85,53.34
SCL  (via drill 0.61)
  Top 0.254: v18.57,54.29 19.05,54.77 19.05,54.93 19.68,55.56 U$2.6 | v14.29,49.85 11.43,49.85 R16.2
  Bottom 0.254: IC6.6 25.56,51.28 21.59,51.28 v18.57,54.29 18.57,54.13 v14.29,49.85
SDA  (via drill 0.61)
  Top 0.254: v18.41,56.99 U$2.5 | v13.49,59.37 11.43,59.37 R15.2
  Bottom 0.254: IC6.5 27.62,51.75 23.65,51.75 v18.41,56.99 15.88,56.99 v13.49,59.37
SQ
  Top 0.254: U$2.7 20.95,55.56 20.32,54.93 20.32,54.77 18.73,53.18 16.67,53.18 15.56,52.07 R11.1
TX  (via drill 0.61)
  Top 0.254: v12.7,34.29 1.27,45.72 1.27,74.93 5.08,78.74 81.28,78.74 82.55,77.47 82.55,74.93 81.28,73.66 67.31,73.66 J1.8
  Bottom 0.254: JP2.1 87.63,5.08 87.63,2.54 31.75,2.54 12.7,21.59 v12.7,34.29
UVLO  (via drill 0.6)
  Top 0.254: R18.1 C4.2 42.33,27.3 R19.2 39.59,26.45 v40.64,25.4 | U2.7 36.06,24 36.83,24.77 v37.47,24.77
  Bottom 0.254: v37.47,24.77 40.01,24.77 v40.64,25.4
VCC  (via drill 0.6, 0.61)
  Top 0.254: IC4.P$3 53.34,15.24 53.34,14.76 IC4.P$4 53.18,14.76 52.7,14.76 52.23,14.29 52.23,3.33 53.02,2.54 R23.2 | R25.2 65.41,2.86 61.75,2.86 R26.2 | R23.2 57.63,2.54 57.78,2.7 R27.2 | C9.1 20.32,15.24 21.43,16.35 24.77,16.35 25.88,15.24 D2.C 26.04,15.24 26.04,13.49 33.66,5.87 37.62,5.87 C10.+ 39.37,7.46 45.4,1.43 51.75,1.43 52.86,2.54 R23.2 | 55.24,17.3 54.77,17.3 | 55.24,17.3 55.72,17.3 IC4.P$17 | 55.24,17.3 IC4.P$18 | 54.77,17.3 54.77,17.78 54.61,17.94 v52.86,17.94 | 54.77,17.3 IC4.P$19 | IC4.P$9 55.74,12.2 55.88,12.06 56.52,12.06 v57.15,12.7
  Top 0.406: R27.2 R26.2
  Bottom 0.254: 46.04,11.11 42.55,7.62 C10.+ | 46.04,11.11 v52.86,17.94 | 46.04,11.11 46.99,10.16 55.88,10.16 57.15,11.43 v57.15,12.7
VIN  (via drill 0.6, 0.61)
  Top 0.254: 53.42,16.43 54.13,17.14 IC4.P$20 | 53.42,16.43 53.34,16.35 IC4.P$1 | 43.18,25.4 45.72,25.4 R18.2 | 40.64,22.86 43.18,25.4 | 40.64,22.86 C6.1 40.01,24.77 39.37,25.4 | v48.26,16.51 53.34,16.51 53.42,16.43 | v45.72,16.51 44.45,16.51 C7.1 43.18,16.51 38.1,16.51 L1.P$2 38.33,18.82 38.1,19.05 37.62,19.05 U2.5 36.56,18.68 v36.83,18.41 | C4.1 42.97,25.4 43.18,25.4 | U2.8 35.56,24.13 37.47,26.04 38.73,26.04 39.37,25.4 | U2.6 37.03,23.07 39.37,25.4 | 40.64,22.86 v43.18,20.32
  Bottom 0.254: v45.72,16.51 v48.26,16.51 | v36.83,18.41 41.27,18.41 v43.18,20.32